# EAGLE design 7segement2digits1badidea-mk-5.0 (EAGLE 6.5.0)
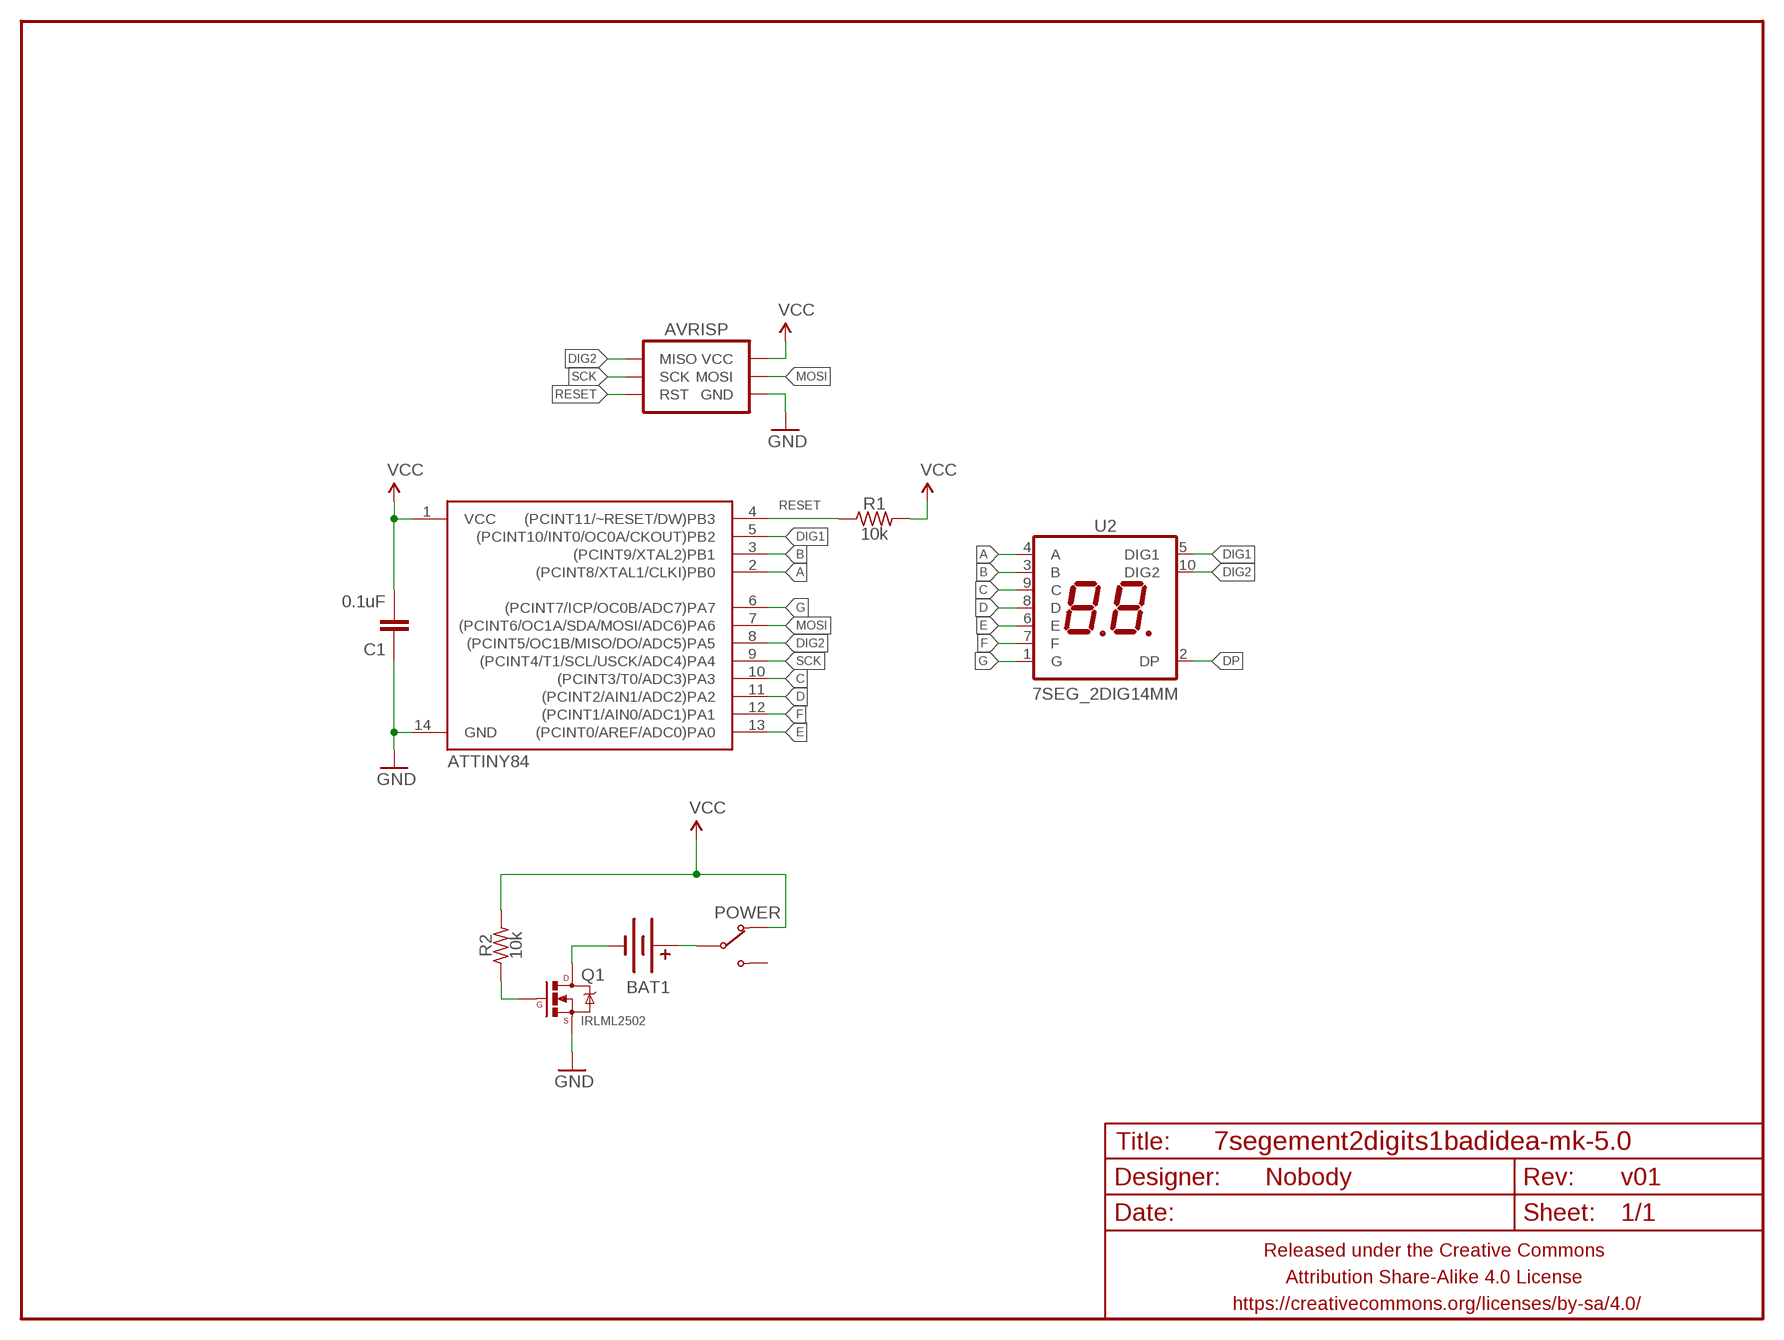
[diagram p0: schematic, sheet 1]

## Parts
AVRISP  AVR_SPI_PRG_6PTH  [2X3]
BAT1  BATTERY20PTH_TOPLOAD  [BATTCON_20MM_PTH_TOPLOAD]
C1  0.1uF  CAPACITOR-CERAMICC0805  [C0805]
FRAME1  FRAME-LETTERNO_PACKAGE  [DUMMY]
POWER  SWITCH-SPDTPTH-RA-2.54MM  [SPDT-RA-2.54MM]
Q1  IRLML2502  MOSFET-NCHANNELIRLML2502  [SOT23]
R1  10k  RESISTORR0805  [R0805]
R2  10k  RESISTORR0805  [R0805]
U1  ATTINY84  [SO14]
U2  7SEG_2DIG14MM  [7SEG_2DIG_14MM]

## Nets
A: U1.2((PCINT8/XTAL1/CLKI)PB0) U2.4(A)
B: U1.3((PCINT9/XTAL2)PB1) U2.3(B)
C: U1.10((PCINT3/T0/ADC3)PA3) U2.9(C)
D: U1.11((PCINT2/AIN1/ADC2)PA2) U2.8(D)
DIG1: U1.5((PCINT10/INT0/OC0A/CKOUT)PB2) U2.5(DIG1)
DIG2: AVRISP.1(MISO) U1.8((PCINT5/OC1B/MISO/DO/ADC5)PA5) U2.10(DIG2)
DP: U2.2(DP)
E: U1.13((PCINT0/AREF/ADC0)PA0) U2.6(E)
F: U1.12((PCINT1/AIN0/ADC1)PA1) U2.7(F)
G: U1.6((PCINT7/ICP/OC0B/ADC7)PA7) U2.1(G)
GND: AVRISP.6(GND) C1.1 Q1.2(S) U1.14(GND)
MOSI: AVRISP.4(MOSI) U1.7((PCINT6/OC1A/SDA/MOSI/ADC6)PA6)
N$1: BAT1.+ POWER.2(COM)
N$2: BAT1.- Q1.3(D)
N$3: Q1.1(G) R2.1
RESET: AVRISP.5(RST) R1.1 U1.4((PCINT11/~RESET/DW)PB3)
SCK: AVRISP.3(SCK) U1.9((PCINT4/T1/SCL/USCK/ADC4)PA4)
VCC: AVRISP.2(VCC) C1.2 POWER.1(NC) R1.2 R2.2 U1.1(VCC)
Unconnected: POWER.3(NO)

## Library data of the parts
AVRISP = A_butts:AVR_SPI_PRG_6: AVR ISP 6 Pin This is the reduced ISP connector for AVR programming. Common on Arduino. This footprint will take up less PCB space and can be used with a 10-pin to 6-pin adapter such as SKU: BOB-08508 **Special note about "TEST_POINT" package. The stop mask is on the top side, so if you want your programming test points to be on the bottom of your board, make sure to place this package on the bottom side of the board. This also ensure that the orientation to program from the bottom side will be correct.
BAT1 = A_butts:BATTERY: Battery Holders Various common sizes : AA, AAA, 20mm coin cell and 12mm coin cell. 20MM_4LEGS, BATT-10373
C1 = A_butts:CAPACITOR-CERAMIC: CAPACITOR, European symbol
FRAME1 = A_butts:FRAME-LETTER: Schematic Frame Standard 8.5x11 US Letter frame; DESIGNER: Nobody; VERSION: v01
POWER = A_butts:SWITCH-SPDT
Q1 = A_butts:MOSFET-NCHANNEL: Common NMOSFET Parts MFG P/N Store ID Prod ID FDD8780 TRANS-09984 SI7820DN TRANS-11055 FDS6630A IC-08089 2N7002PW TRANS-11151 FQP30N06L COM-10213 TRANS-10060 BSS123LT1G TRANS-08345 BSS138 TRANS-00830 BS170 2N7000
R1 R2 = A_butts:RESISTOR: RESISTOR, American symbol
U1 = A_butts:ATTINY84: Atmel 14-pin 2/4/8kB flash uC
U2 = A_butts:7SEG_2DIG

## Board
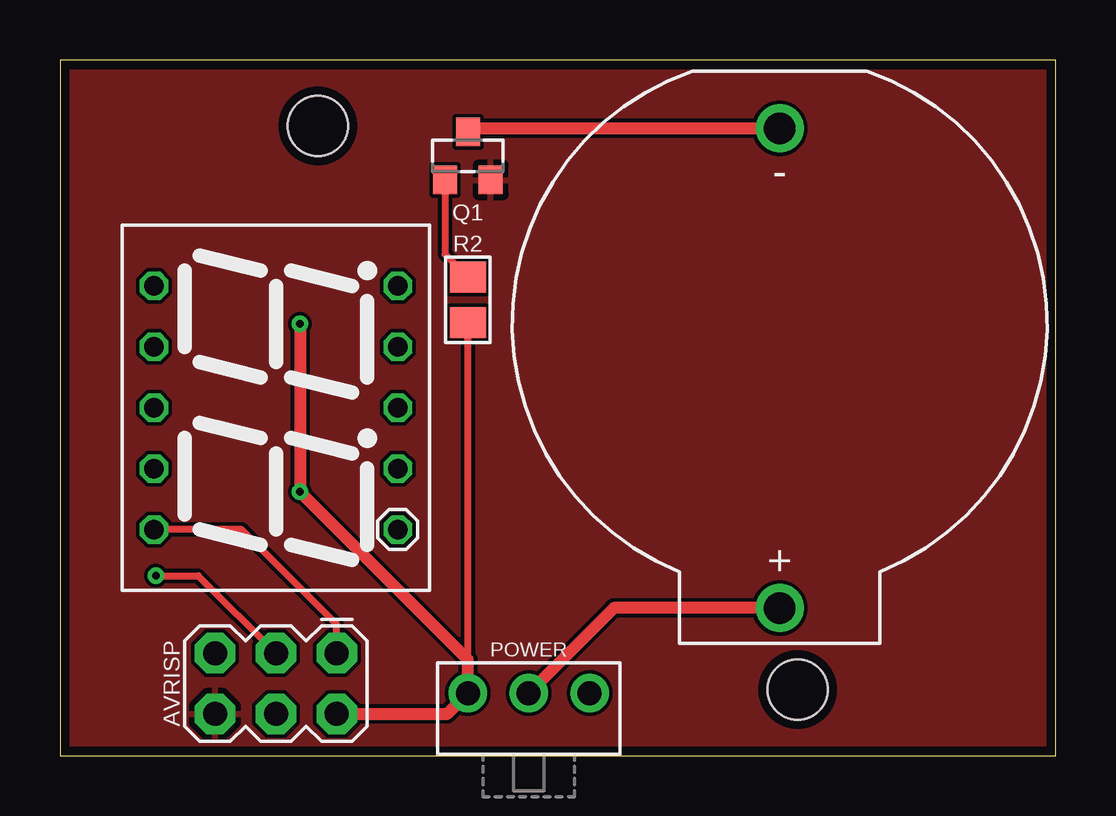
[diagram p1: board, top side]
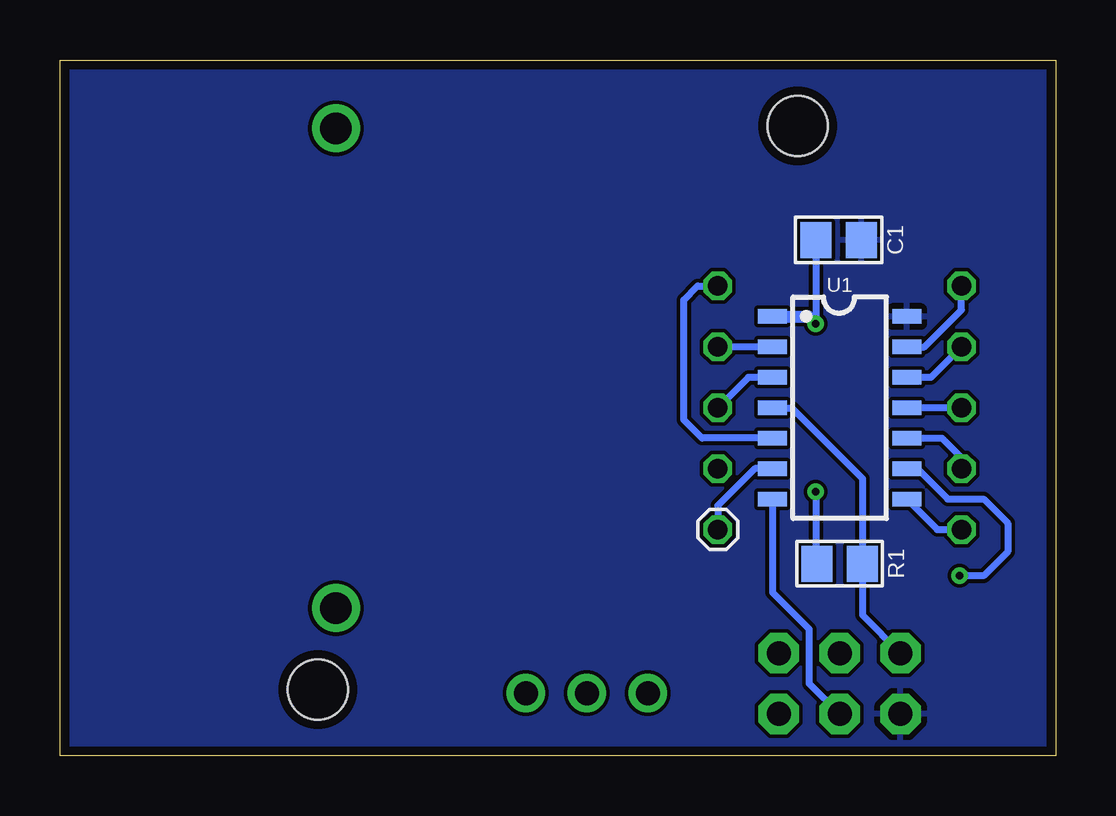
[diagram p2: board, bottom side, seen from below]

Size 41.5 x 29 mm. Coordinates in mm from the lower left corner, seen from the top.
Outline: 0,29 0,0 41.5,0 41.5,29 0,29
Copper layers (1*16): Top 0.0356mm / dielectric 1.5011mm / Bottom 0.0356mm
Design rules "LaenPCBOrder_2": minimum track width 6mil, minimum drill 13mil, track to track 6mil, track to pad 6mil, pad to pad 6mil, via to via 6mil, smd to smd 6mil, copper to edge 15mil, drill to drill 6mil, minimum pad ring 7mil, minimum via ring 7mil, stop-mask expansion 3mil, vias tented up to drill 20mil, thermal gap 10mil
Holes 2.5 mm at 10.75,26.25 30.75,2.75

### Footprints (pad centres in the part's own frame; a part is rotated, then mirrored left to right if it is on the bottom)
2X3 = drill 1 pad 1.676 octagon: 1 -2.54,-1.27; 2 -2.54,1.27; 3 0,-1.27; 4 0,1.27; 5 2.54,-1.27; 6 2.54,1.27
BATTCON_20MM_PTH_TOPLOAD = drill 1.3 pad 2: + 11.85,0; - -8.15,0
C0805 = smd 1.3 x 1.5: 1 -0.95,0; 2 0.95,0
SPDT-RA-2.54MM = drill 1 pad 1.6: 1 0,0; 2 2.54,0; 3 5.08,0
SOT23 = smd 1 x 1.2: 1 -0.95,-1; 2 0.95,-1; 3 0,1
R0805 = smd 1.3 x 1.5: 1 -0.95,0; 2 0.95,0
SO14 = smd 0.6 x 1.2: 1 -3.81,-2.8; 2 -2.54,-2.8; 3 -1.27,-2.8; 4 0,-2.8; 5 1.27,-2.8; 6 2.54,-2.8; 7 3.81,-2.8; 8 3.81,2.8; 9 2.54,2.8; 10 1.27,2.8; 11 0,2.8; 12 -1.27,2.8; 13 -2.54,2.8; 14 -3.81,2.8
7SEG_2DIG_14MM = drill 0.8 octagon: 1 -5.08,-5.08; 2 -2.54,-5.08; 3 0,-5.08; 4 2.54,-5.08; 5 5.08,-5.08; 6 5.08,5.08; 7 2.54,5.08; 8 0,5.08; 9 -2.54,5.08; 10 -5.08,5.08

### Placement (x,y rotation side)
AVRISP  9,3 180 top
BAT1  30,18 270 top
C1  9.04,21.5 180 bottom
FRAME1  0,-0.5 0 top
POWER  17,2.6 0 top
Q1  17,25 0 top
R1  9,8 180 bottom
R2  17,19 270 top
U1  9,14.5 270 bottom
U2  9,14.5 90 top

### Tracks (layer width: path | path; a pad name or v marks a point on that pad's centre or on a via)
A
  Bottom 0.3: U1.2 U2.4
B
  Bottom 0.3: U1.3 12.81,15.77 U2.3
C
  Bottom 0.3: U1.10 4.73,13.23 3.92,12.42 U2.9
D
  Bottom 0.3: U2.8 U1.11
DIG1
  Bottom 0.3: U1.5 14.73,13.23 15.5,14 15.5,19 14.92,19.58 U2.5
DIG2
  Top 0.3: AVRISP.1 11.54,5.46 7.58,9.42 U2.10
  Bottom 0.3: U1.8 4.93,9.42 U2.10
E
  Bottom 0.3: U1.13 5.46,17.04 3.92,18.58 U2.6
F
  Bottom 0.3: U2.7 5.19,15.77 U1.12
G
  Bottom 0.3: U1.6 12.54,11.96 14.08,10.42 U2.1
GND
  pour Top: 41.6,29.1 41.6,-0.1 -0.1,-0.1 -0.1,29.1
  pour Bottom: -0.1,-0.1 -0.1,29.1 41.6,29.1 41.6,-0.1
MOSI
  Bottom 0.3: U1.7 11.8,6.8 10.27,5.27 10.27,3 AVRISP.4
N$1
  Top 0.5: BAT1.+ 23.09,6.15 POWER.2
N$2
  Top 0.5: Q1.3 17.15,26.15 BAT1.-
N$3
  Top 0.3: Q1.1 16.05,20.9 R2.1
RESET
  Bottom 0.3: U1.4 11,14.5 8.05,11.55 R1.1 8.05,5.86 AVRISP.5
SCK  (via drill 0.33)
  Top 0.3: v4,7.5 5.77,7.5 AVRISP.3
  Bottom 0.3: v4,7.5 3,7.5 2,8.5 2,9.69 3,10.69 4.5,10.69 5.77,11.96 U1.9
VCC  (via drill 0.33)
  Top 0.3: 17,4 R2.2
  Top 0.5: v10,18 v10,11 17,4 POWER.1 16.13,1.73 AVRISP.2
  Bottom 0.3: C1.2 v9.99,18.01 v10,18 | v10,11 10,8.05 R1.2
  Bottom 0.5: U1.1 10.31,18.31 v10,18